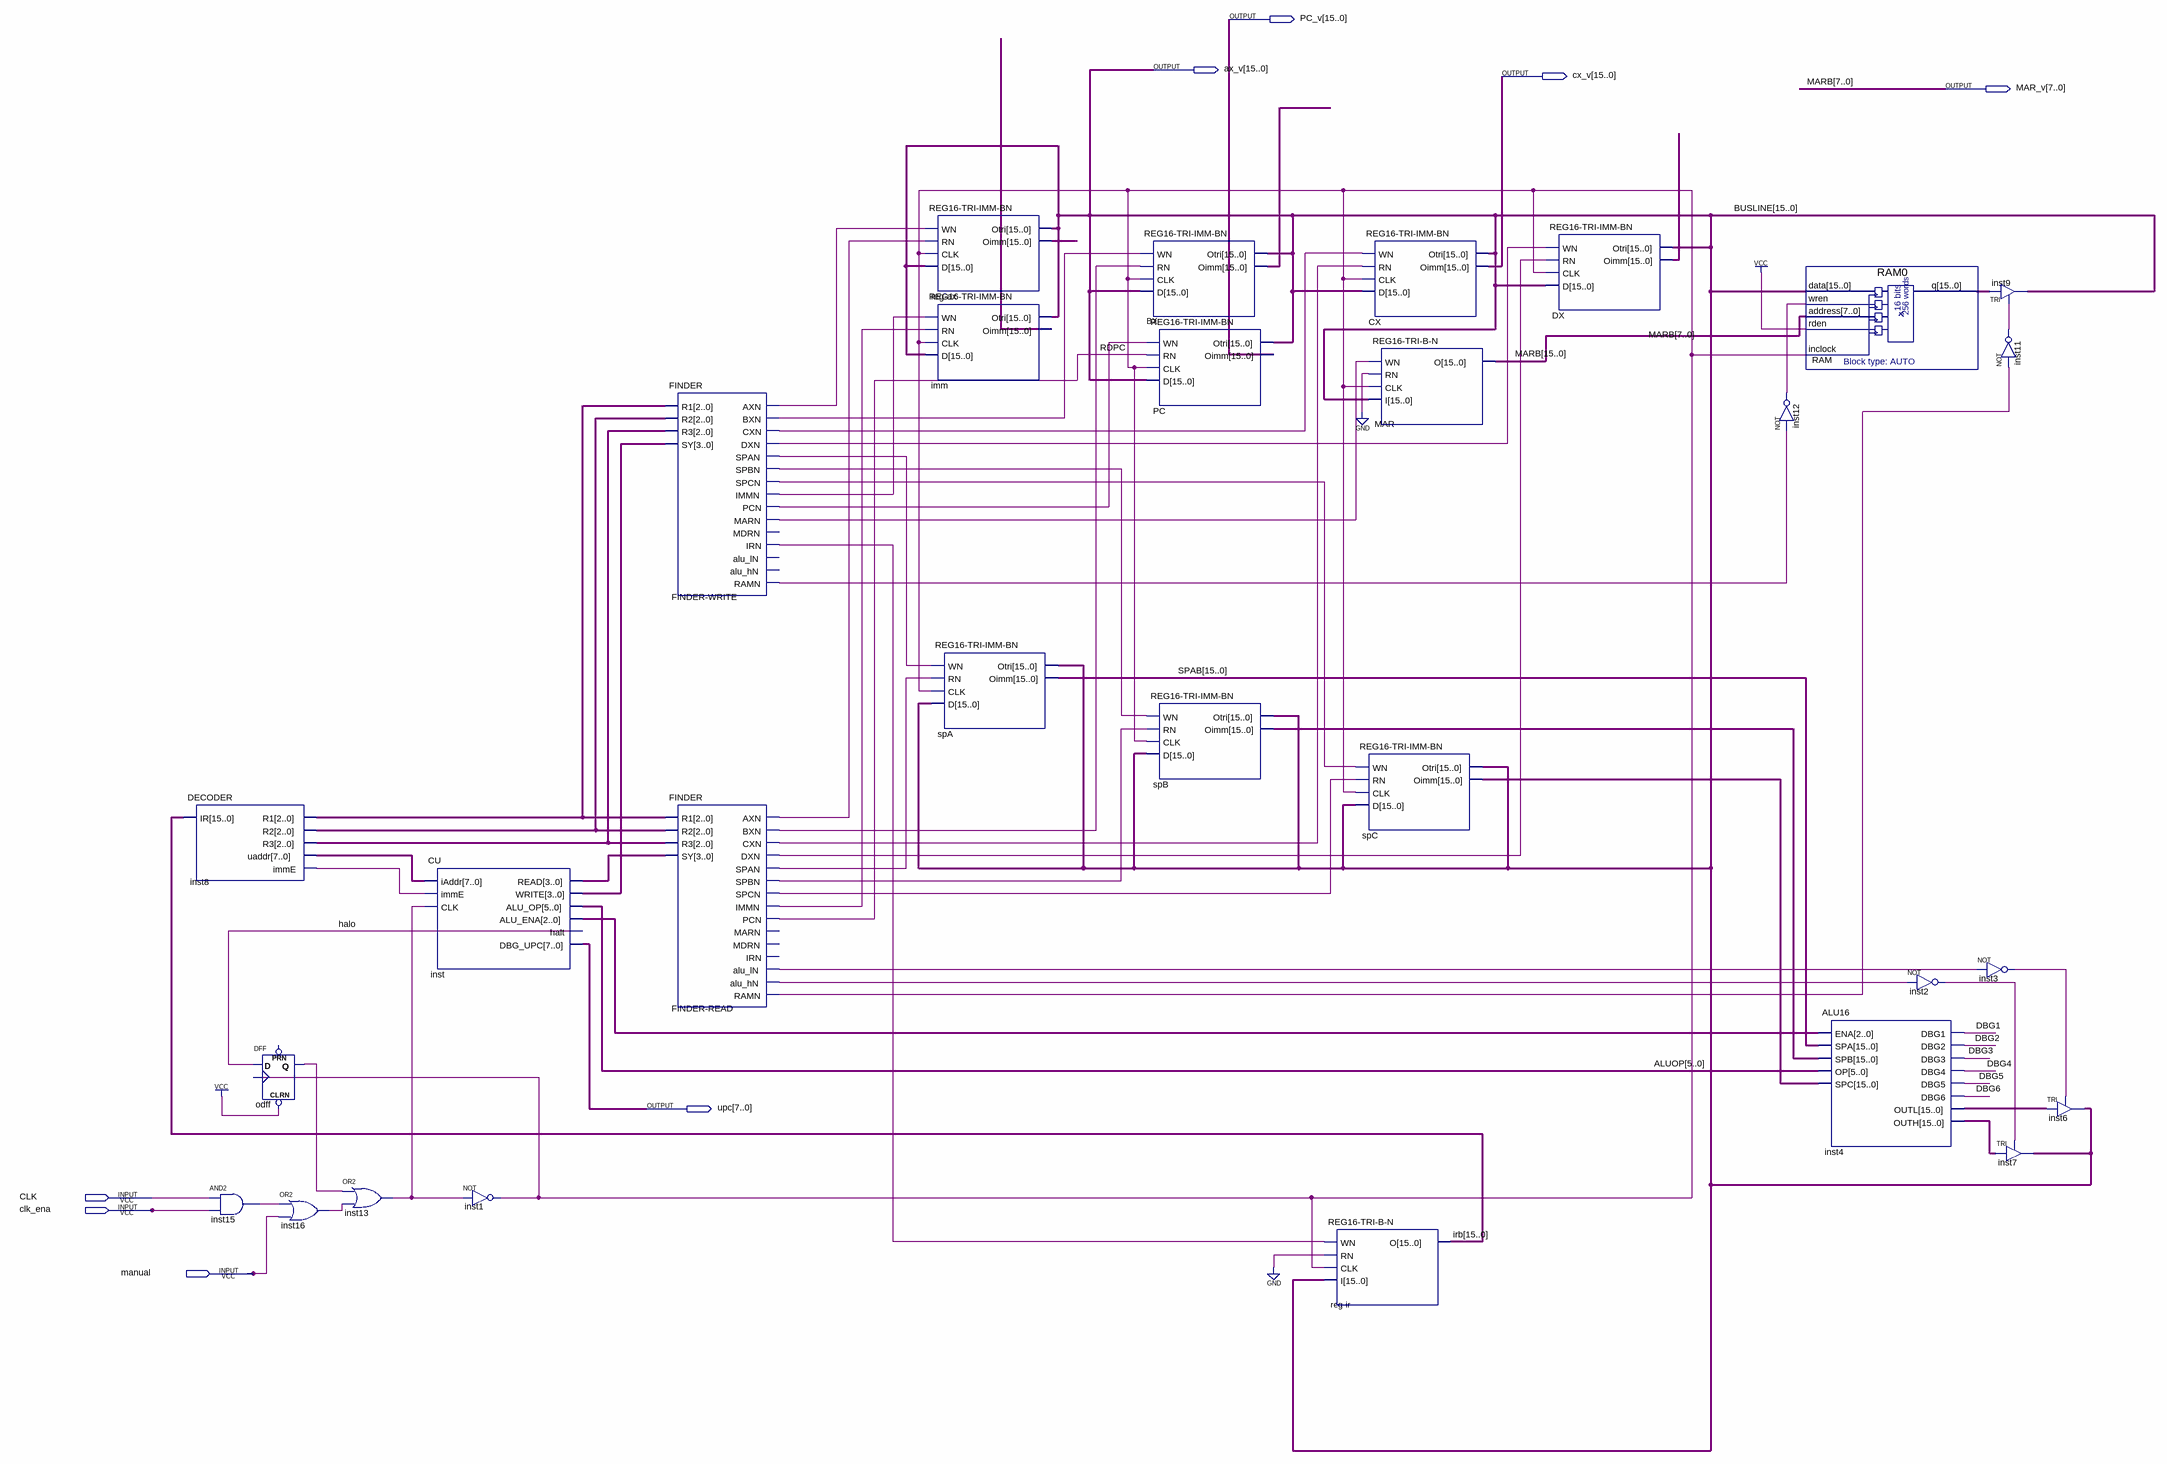
[diagram p0: schematic sheet]
// Quartus schematic EXP33.bdf as structural Verilog: 29 symbols, 8 pins
module EXP33 (
  input  CLK,
  input  clk_ena,
  input  manual,
  output [15:0] PC_v,
  output [15:0] ax_v,
  output [15:0] cx_v,
  output [7:0] MAR_v,
  output [7:0] upc
);

  wire DBG1, DBG2, DBG3, DBG4, DBG5, DBG6, FINDER_READ_alu_hn, FINDER_READ_alu_ln, FINDER_READ_axn,
       FINDER_READ_bxn, FINDER_READ_cxn, FINDER_READ_dxn, FINDER_READ_immn, FINDER_READ_ramn,
       FINDER_READ_span, FINDER_READ_spbn, FINDER_READ_spcn, FINDER_WRITE_axn, FINDER_WRITE_bxn,
       FINDER_WRITE_cxn, FINDER_WRITE_dxn, FINDER_WRITE_immn, FINDER_WRITE_irn, FINDER_WRITE_marn,
       FINDER_WRITE_pcn, FINDER_WRITE_ramn, FINDER_WRITE_span, FINDER_WRITE_spbn, FINDER_WRITE_spcn, halo,
       inst1_out, inst2_out, inst3_out, inst8_imme, inst11_out, inst12_out, inst13_out, inst15_out,
       inst16_out, odff_q, RDPC;
  wire [2:0] inst8_r1, inst8_r2, inst8_r3, inst_alu_ena;
  wire [3:0] inst_read, inst_write;
  wire [5:0] ALUOP;
  wire [7:0] inst8_uaddr;
  wire [15:0] BX_oimm, DX_oimm, imm_oimm, inst4_outh, inst4_outl, irb, RAM_q, reg_ax_oimm, SPAB, spB_oimm,
       spC_oimm;
  wire [15:8] MARB;

  DECODER inst8 (.IR(irb), .R1(inst8_r1), .R2(inst8_r2), .R3(inst8_r3), .uaddr(inst8_uaddr), .immE(inst8_imme));
  and inst15 (inst15_out, CLK, clk_ena);
  DFF odff (.CLRN(1'b1), .CLK(inst1_out), .D(halo), .Q(odff_q));  // open: PRN
  or inst16 (inst16_out, inst15_out, manual);
  or inst13 (inst13_out, odff_q, inst16_out);
  CU inst (
    .iAddr(inst8_uaddr), .immE(inst8_imme), .CLK(inst13_out), .READ(inst_read), .WRITE(inst_write),
    .ALU_OP(ALUOP), .ALU_ENA(inst_alu_ena), .halt(halo), .DBG_UPC(upc));
  not inst1 (inst1_out, inst13_out);
  FINDER \FINDER-WRITE  (
    .R1(inst8_r1), .R2(inst8_r2), .R3(inst8_r3), .SY(inst_write), .AXN(FINDER_WRITE_axn),
    .BXN(FINDER_WRITE_bxn), .CXN(FINDER_WRITE_cxn), .DXN(FINDER_WRITE_dxn), .SPAN(FINDER_WRITE_span),
    .SPBN(FINDER_WRITE_spbn), .SPCN(FINDER_WRITE_spcn), .IMMN(FINDER_WRITE_immn), .PCN(FINDER_WRITE_pcn),
    .MARN(FINDER_WRITE_marn), .IRN(FINDER_WRITE_irn), .RAMN(FINDER_WRITE_ramn));  // open: MDRN, alu_lN, alu_hN
  FINDER \FINDER-READ  (
    .R1(inst8_r1), .R2(inst8_r2), .R3(inst8_r3), .SY(inst_read), .AXN(FINDER_READ_axn),
    .BXN(FINDER_READ_bxn), .CXN(FINDER_READ_cxn), .DXN(FINDER_READ_dxn), .SPAN(FINDER_READ_span),
    .SPBN(FINDER_READ_spbn), .SPCN(FINDER_READ_spcn), .IMMN(FINDER_READ_immn), .PCN(RDPC),
    .alu_lN(FINDER_READ_alu_ln), .alu_hN(FINDER_READ_alu_hn), .RAMN(FINDER_READ_ramn));  // open: MARN, MDRN, IRN
  \REG16-TRI-IMM-BN  \reg-ax  (
    .WN(FINDER_WRITE_axn), .RN(FINDER_READ_axn), .CLK(inst1_out), .D(ax_v), .Otri(ax_v), .Oimm(reg_ax_oimm));
  \REG16-TRI-IMM-BN  imm (
    .WN(FINDER_WRITE_immn), .RN(FINDER_READ_immn), .CLK(inst1_out), .D(ax_v), .Otri(ax_v), .Oimm(imm_oimm));
  \REG16-TRI-IMM-BN  spA (
    .WN(FINDER_WRITE_span), .RN(FINDER_READ_span), .CLK(inst1_out), .D(ax_v), .Otri(ax_v), .Oimm(SPAB));
  \REG16-TRI-IMM-BN  BX (
    .WN(FINDER_WRITE_bxn), .RN(FINDER_READ_bxn), .CLK(inst1_out), .D(ax_v), .Otri(ax_v), .Oimm(BX_oimm));
  \REG16-TRI-IMM-BN  PC (.WN(FINDER_WRITE_pcn), .RN(RDPC), .CLK(inst1_out), .D(ax_v), .Otri(ax_v), .Oimm(PC_v));
  \REG16-TRI-IMM-BN  spB (
    .WN(FINDER_WRITE_spbn), .RN(FINDER_READ_spbn), .CLK(inst1_out), .D(ax_v), .Otri(ax_v), .Oimm(spB_oimm));
  \REG16-TRI-IMM-BN  CX (
    .WN(FINDER_WRITE_cxn), .RN(FINDER_READ_cxn), .CLK(inst1_out), .D(ax_v), .Otri(ax_v), .Oimm(cx_v));
  \REG16-TRI-IMM-BN  spC (
    .WN(FINDER_WRITE_spcn), .RN(FINDER_READ_spcn), .CLK(inst1_out), .D(ax_v), .Otri(ax_v), .Oimm(spC_oimm));
  \REG16-TRI-B-N  \reg-ir  (.WN(FINDER_WRITE_irn), .RN(1'b0), .CLK(inst1_out), .I(ax_v), .O(irb));
  \REG16-TRI-B-N  MAR (.WN(FINDER_WRITE_marn), .RN(1'b0), .CLK(inst1_out), .I(ax_v), .O({MARB, MAR_v}));
  \REG16-TRI-IMM-BN  DX (
    .WN(FINDER_WRITE_dxn), .RN(FINDER_READ_dxn), .CLK(inst1_out), .D(ax_v), .Otri(ax_v), .Oimm(DX_oimm));
  RAM0 RAM (.data(ax_v), .wren(inst12_out), .address(MAR_v), .rden(1'b1), .inclock(inst1_out), .q(RAM_q));
  not inst12 (inst12_out, FINDER_WRITE_ramn);
  ALU16 inst4 (
    .ENA(inst_alu_ena), .SPA(SPAB), .SPB(spB_oimm), .OP(ALUOP), .SPC(spC_oimm), .DBG1(DBG1), .DBG2(DBG2),
    .DBG3(DBG3), .DBG4(DBG4), .DBG5(DBG5), .DBG6(DBG6), .OUTL(inst4_outl), .OUTH(inst4_outh));
  not inst2 (inst2_out, FINDER_READ_alu_hn);
  TRI inst9[15:0] (.IN(RAM_q), .OE(inst11_out), .OUT(ax_v));
  not inst11 (inst11_out, FINDER_READ_ramn);
  not inst3 (inst3_out, FINDER_READ_alu_ln);
  TRI inst7[15:0] (.IN(inst4_outh), .OE(inst2_out), .OUT(ax_v));
  TRI inst6[15:0] (.IN(inst4_outl), .OE(inst3_out), .OUT(ax_v));

  // Other names for the same wires on the sheet: BUSLINE[15:0] = ax_v; MARB[7:0] = MAR_v
endmodule
